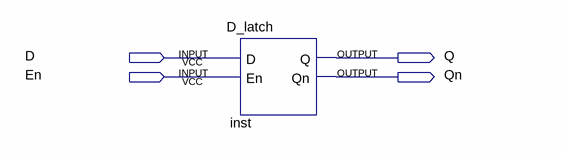
[diagram p0: schematic sheet]
// Quartus schematic L0702.bdf as structural Verilog: 1 symbols, 4 pins
module L0702 (
  input  D,
  input  En,
  output Q,
  output Qn
);

  D_latch inst (.D(D), .En(En), .Q(Q), .Qn(Qn));
endmodule
